# Altium schematic sheet Connectors.SchDoc
size A4
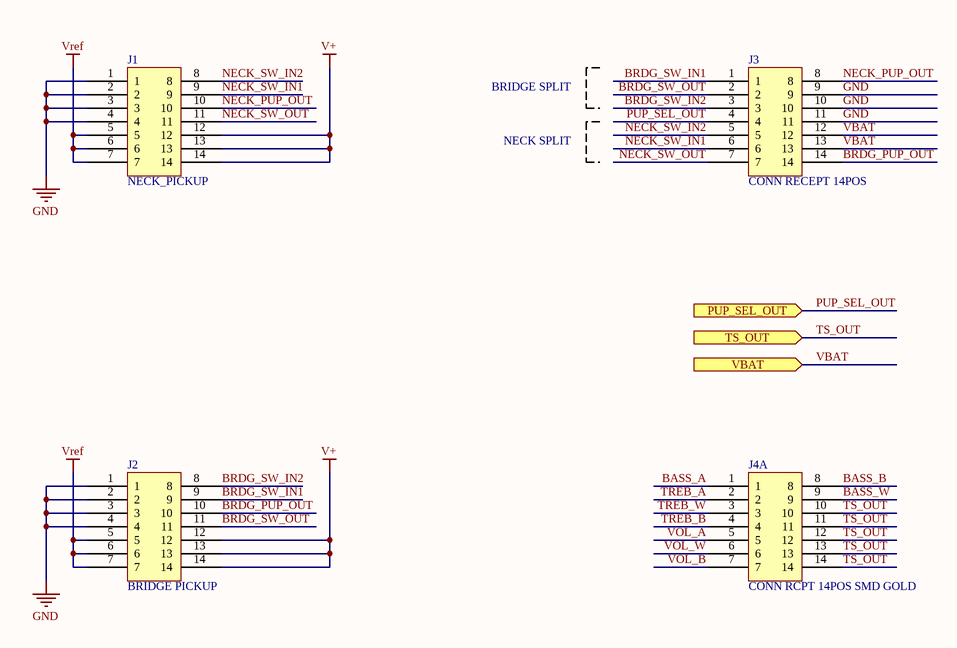
[diagram p0: Connectors.SchDoc]

## Parts
J1  CONN HEADER 14POS  [DF12(3.0)-14DP]  (value not drawn)
J2  CONN HEADER 14POS  [DF12(3.0)-14DP]  (value not drawn)
J3  CONN RECEPT 14POS  [DF12(3.0)-14DS]
J4  CONN RCPT 14POS SMD GOLD  [DF12(3.0)-14DS]  (part A of 4)

## Ports
PUP_SEL_OUT (in), TS_OUT (in), VBAT (in)

## Nets
GND: J1.1 J1.2 J1.3 J1.4 J2.1 J2.2 J2.3 J2.4 J3.9 J3.10 J3.11
V+: J1.12 J1.13 J1.14 J2.12 J2.13 J2.14
Vref: J1.5 J1.6 J1.7 J2.5 J2.6 J2.7
BASS_A: J4.1
BASS_B: J4.8
BASS_W: J4.9
BRDG_PUP_OUT: J2.10 J3.14
BRDG_SW_IN1: J2.9 J3.1
BRDG_SW_IN2: J2.8 J3.3
BRDG_SW_OUT: J2.11 J3.2
NECK_PUP_OUT: J1.10 J3.8
NECK_SW_IN1: J1.9 J3.6
NECK_SW_IN2: J1.8 J3.5
NECK_SW_OUT: J1.11 J3.7
PUP_SEL_OUT: J3.4 ; port PUP_SEL_OUT
TREB_A: J4.2
TREB_B: J4.4
TREB_W: J4.3
TS_OUT: J4.10 J4.11 J4.12 J4.13 J4.14 ; port TS_OUT
VBAT: J3.12 J3.13 ; port VBAT
VOL_A: J4.5
VOL_B: J4.7
VOL_W: J4.6

## Notes on the sheet
- BRIDGE SPLIT
- NECK SPLIT
- (near J1) NECK_PICKUP
- (near J2) BRIDGE PICKUP

## Library data of the parts
J1 J2 = DF12(3.0)-14DP-0.5V(86): 14 Position Connector Header, Outer Shroud Contacts Surface Mount Gold; Manufacturer: Hirose; Digikey Part Number: H11701CT-ND
J3 = DF12(3.0)-14DS-0.5V(86): 14 Position Connector Receptacle, Center Strip Contacts Surface Mount Gold; Manufacturer: Hirose; Digikey Part Number: H11702CT-ND
J4 = DF12(3.0)-14DS-0.5V(86)-COMPOSITE: 14 Position Connector Header, Outer Shroud Contacts Surface Mount Gold; Manufacturer: Hirose; Digikey Part Number: H11702CT-ND